# EAGLE design dualevse (EAGLE 9.5.0)
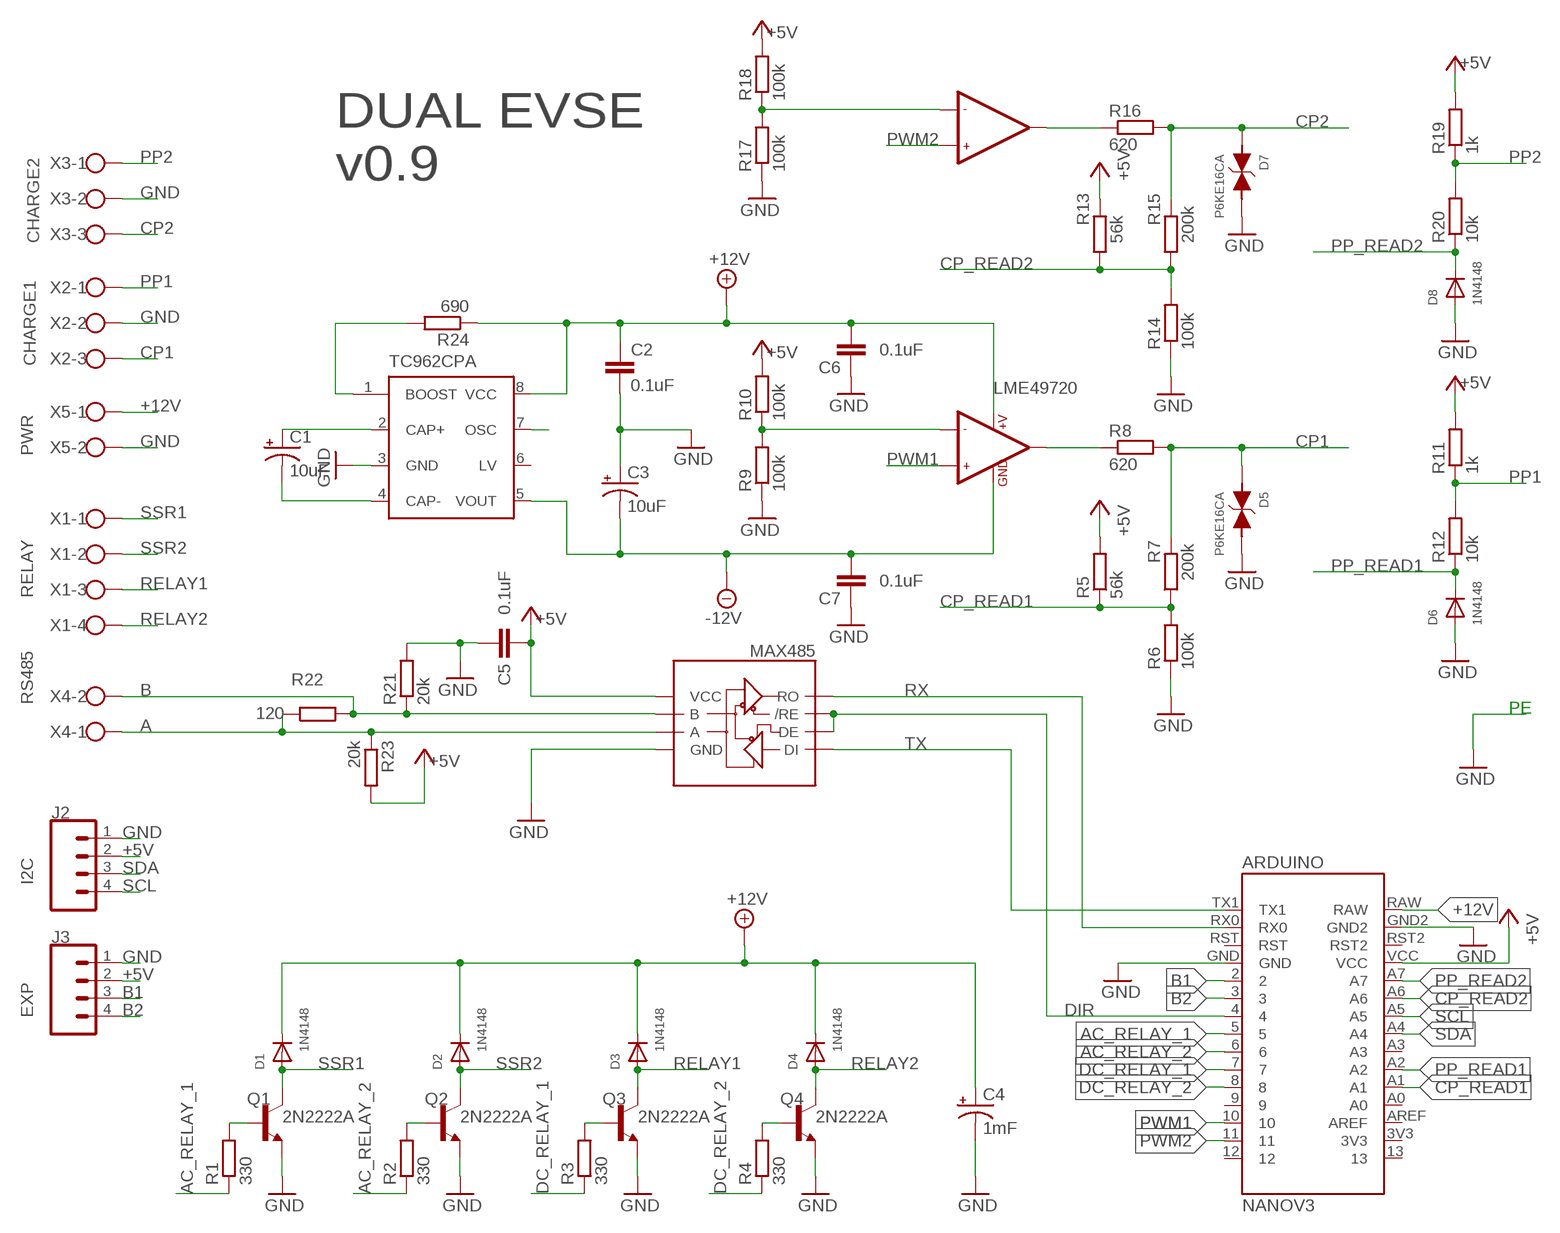
[diagram p0: schematic, sheet 1]

## Parts
ARDUINO  NANOV3  [NANOV3]
C1  10uF  10UF-POLAR-RADIAL-2.5MM-25V-20%  [CPOL-RADIAL-2.5MM-5MM]
C2  0.1uF  0.1UF-KIT-EZ-50V-20%  [CAP-PTH-SMALL-KIT]
C3  10uF  10UF-POLAR-RADIAL-2.5MM-25V-20%  [CPOL-RADIAL-2.5MM-5MM]
C4  1mF  1000UF-RADIAL-5MM-25V-20%  [CPOL-RADIAL-5MM-10MM]
C5  0.1uF  0.1UF-KIT-EZ-50V-20%  [CAP-PTH-SMALL-KIT]
C6  0.1uF  0.1UF-KIT-EZ-50V-20%  [CAP-PTH-SMALL-KIT]
C7  0.1uF  0.1UF-KIT-EZ-50V-20%  [CAP-PTH-SMALL-KIT]
D1  1N4148  DIODEDO-1N4148  [DO-1N4148]
D2  1N4148  DIODEDO-1N4148  [DO-1N4148]
D3  1N4148  DIODEDO-1N4148  [DO-1N4148]
D4  1N4148  DIODEDO-1N4148  [DO-1N4148]
D5  P6KE16CA  TVSDO2  [C4111-15]
D6  1N4148  DIODEDO-1N4148  [DO-1N4148]
D7  P6KE16CA  TVSDO2  [C4111-15]
D8  1N4148  DIODEDO-1N4148  [DO-1N4148]
J2  I2C  CONN_04POLAR  [MOLEX-1X4]
J3  EXP  CONN_04POLAR  [MOLEX-1X4]
LME49720  LME49720  LF353DIL08  [TEXAS_DIL08]
MAX485  SPARKFUN-IC-COMMS_RS485  [TEXAS_DIL08]
Q1  2N2222A  [TO18]
Q2  2N2222A  [TO18]
Q3  2N2222A  [TO18]
Q4  2N2222A  [TO18]
R1  330  R-EU_0207/10  [0207/10]
R2  330  R-EU_0207/10  [0207/10]
R3  330  R-EU_0207/10  [0207/10]
R4  330  R-EU_0207/10  [0207/10]
R5  56k  R-EU_0207/10  [0207/10]
R6  100k  R-EU_0207/10  [0207/10]
R7  200k  R-EU_0207/10  [0207/10]
R8  620  R-EU_0207/10  [0207/10]
R9  100k  R-EU_0207/10  [0207/10]
R10  100k  R-EU_0207/10  [0207/10]
R11  1k  R-EU_0207/10  [0207/10]
R12  10k  R-EU_0207/10  [0207/10]
R13  56k  R-EU_0207/10  [0207/10]
R14  100k  R-EU_0207/10  [0207/10]
R15  200k  R-EU_0207/10  [0207/10]
R16  620  R-EU_0207/10  [0207/10]
R17  100k  R-EU_0207/10  [0207/10]
R18  100k  R-EU_0207/10  [0207/10]
R19  1k  R-EU_0207/10  [0207/10]
R20  10k  R-EU_0207/10  [0207/10]
R21  20k  R-EU_0207/10  [0207/10]
R22  120  R-EU_0207/10  [0207/10]
R23  20k  R-EU_0207/10  [0207/10]
R24  690  R-EU_0207/10  [0207/10]
TC962CPA  TEXAS_TL7660  [TEXAS_DIL08]
X1  RELAY  W237-4  [W237-4]
X2  CHARGE1  W237-103  [W237-103]
X3  CHARGE2  W237-103  [W237-103]
X4  RS485  W237-102  [W237-102]
X5  PWR  W237-102  [W237-102]

## Nets
+5V [PWR]: ARDUINO.VCC C5.2 J2.2 J3.2 MAX485.8(VCC) R5.2 R10.2 R11.2 R13.2 R18.2 R19.2 R23.2
+12V [PWR]: ARDUINO.RAW C2.1 C4.+ C6.1 D1.C D2.C D3.C D4.C LME49720.8(+V) R24.1 TC962CPA.8(VCC) X5.1
-12V [PWR]: C3.2(-) C7.2 LME49720.4(GND) TC962CPA.5(VOUT)
A: MAX485.6(A) R22.1 R23.1 X4.1
AC_RELAY_1: ARDUINO.5 R1.1
AC_RELAY_2: ARDUINO.6 R2.1
B: MAX485.7(B) R21.1 R22.2 X4.2
B1: ARDUINO.2 J3.3
B2: ARDUINO.3 J3.4
CP1 [PWR]: D5.A R7.2 R8.2 X2.3
CP2 [PWR]: D7.A R15.2 R16.2 X3.3
CP_READ1: ARDUINO.A1 R5.1 R6.2 R7.1
CP_READ2: ARDUINO.A6 R13.1 R14.2 R15.1
DC_RELAY_1: ARDUINO.7 R3.1
DC_RELAY_2: ARDUINO.8 R4.1
DIR: ARDUINO.4 MAX485.2(/RE) MAX485.3(DE)
GND [GND]: ARDUINO.GND ARDUINO.GND2 C2.2 C3.1(+) C4.- C5.1 C6.2 C7.1 D5.C D6.A D7.C D8.A J2.1 J3.1 MAX485.5(GND) Q1.1(E) Q2.1(E) Q3.1(E) Q4.1(E) R6.1 R9.1 R14.1 R17.1 R21.2 TC962CPA.3(GND) X2.2 X3.2 X5.2
N$1: LME49720.6(-IN2) R17.2 R18.1
N$2: Q3.2(B) R3.2
N$3: Q4.2(B) R4.2
N$4: LME49720.7(OUT2) R16.1
N$5: Q1.2(B) R1.2
N$6: Q2.2(B) R2.2
N$7 [PWR]: R24.2 TC962CPA.1(BOOST)
N$10: LME49720.2(-IN1) R9.2 R10.1
N$11: LME49720.1(OUT1) R8.1
N$36: C1.1(+) TC962CPA.2(CAP+)
N$38: C1.2(-) TC962CPA.4(CAP-)
NC: TC962CPA.7(OSC)
PP1 [PWR]: R11.1 R12.2 X2.1
PP2 [PWR]: R19.1 R20.2 X3.1
PP_READ1: ARDUINO.A2 D6.C R12.1
PP_READ2: ARDUINO.A7 D8.C R20.1
PWM1: ARDUINO.10 LME49720.3(+IN1)
PWM2: ARDUINO.11 LME49720.5(+IN2)
RELAY1 [PWR]: D3.A Q3.3(C) X1.3
RELAY2 [PWR]: D4.A Q4.3(C) X1.4
RX: ARDUINO.RX0 MAX485.1(RO)
SCL: ARDUINO.A5 J2.4
SDA: ARDUINO.A4 J2.3
SSR1 [PWR]: D1.A Q1.3(C) X1.1
SSR2 [PWR]: D2.A Q2.3(C) X1.2
TX: ARDUINO.TX1 MAX485.4(DI)
Unconnected: ARDUINO.3V3 ARDUINO.9 ARDUINO.12 ARDUINO.13 ARDUINO.A0 ARDUINO.A3 ARDUINO.AREF ARDUINO.RST ARDUINO.RST2 TC962CPA.6(LV)

## Notes on the sheet
- DUAL EVSE
  v0.9
- PE

## Library data of the parts
ARDUINO = Arduino Nano by Jazz:NANOV3
C1 C3 = SparkFun-Capacitors:10UF-POLAR: 10.0µF polarized capacitors A capacitor is a passive two-terminal electrical component used to store electrical energy temporarily in an electric field.; PROD_ID: CAP-08440
C2 C5-C7 = SparkFun-Capacitors:0.1UF: 0.1µF ceramic capacitors A capacitor is a passive two-terminal electrical component used to store electrical energy temporarily in an electric field.; PROD_ID: CAP-08370
C4 = SparkFun-Capacitors:1000UF: 1,000µF/1mF ceramic capacitors A capacitor is a passive two-terminal electrical component used to store electrical energy temporarily in an electric field. CAP-08070; PROD_ID: CAP-09538
D1-D4 D6 D8 = adafruit:DIODE: Diode SMADIODE - SMA Surface Mount Package 20V 1A Schottky Diode Digikey: 641-1014-6-ND DO-1N4148 - Through Hole Small Current Diode SOD-123 20V 1 A (.5mV Vf) Schottky Diode - Digikey: MBRX120TPMSCT-ND SOD-323 10V 570mA (.38mV Vf, 3ns) Schottky Diode - Digikey: ZLLS410CT-ND SOD-523 30V 30mA Schottky Diode (RB751S-40TE61) - Digikey: RB751S-40TE61CT-ND SOT23-R/W - SOT23 Package (R = Solder Paste/Reflow Ovens, W = Hand-Soldering) BAT54Film 40V 300mA - Digikey: 497-7162-1-ND
D5 D7 = evse_nano:TVS: WE-TVSP Power TVS Diode <http://katalog.we-online.de/media/images/v2/WE-TVSP_600W-3000W_D0214AA_4C.jpg> Details see: http://katalog.we-online.de/en/pbs/WE-TVSP/824500101 2015 (C) Würth Elektronik
J2 J3 = SparkFun-Connectors:CONN_04: Multi connection point. Often used as Generic Header-pin footprint for 0.1 inch spaced/style header connections On any of the 0.1 inch spaced packages, you can populate with these: Break Away Headers - Straight <https://www.sparkfun.com/products/116> (PRT-00116) Break Away Male Headers - Right Angle <https://www.sparkfun.com/products/553> (PRT-00553) Female Headers <https://www.sparkfun.com/products/115> (PRT-00115) Break Away Headers - Machine Pin <https://www.sparkfun.com/products/117> (PRT-00117) Break Away Female Headers - Swiss Machine Pin <https://www.sparkfun.com/products/743> (PRT-00743) For SCREWTERMINALS and SPRING TERMINALS visit here: Screw Terimnals on SparkFun.com <https://www.sparkfun.com/search/results?term=Screw+Terminals> (5mm/3.5mm/2.54mm spacing) This device is also useful as a general connection point to wire up your design to another part of your project. Our various solder wires solder well into these plated through hole pads. Hook-Up Wire - Assortment (Stranded, 22 AWG) <https://www.sparkfun.com/products/11375> (PRT-11375) Hook-Up Wire - Assortment (Solid Core, 22 AWG) <https://www.sparkfun.com/products/11367> (PRT-11367) View the entire wire category on our website here <https://www.sparkfun.com/categories/141> Special notes: Molex polarized connector foot print use with SKU : PRT-08231 with associated crimp pins and housings. 1MM SMD Version SKU: PRT-10208; PROD_ID: CONN-08186; SF_ID: PRT-08231
LME49720 = evse_nano:LF353
MAX485 = evse_nano:SPARKFUN-IC-COMMS_RS485: RS-485 Transceiver SP3485 Series 8 Pin NSOIC 3.3 V Low Power Half Duplex RS-485 Transceiver MAX3485 compatible Datasheet <http://www.sparkfun.com/datasheets/Components/General/sp3485CN-LTR.pdf> SparkFun Products SparkFun Transceiver Breakout - RS-485 <https://www.sparkfun.com/products/10124> (BOB-10124) SparkFun USB to RS-485 Converter <https://www.sparkfun.com/products/9822> (BOB-09822)
Q1-Q4 = transistor-npn:2N2222*: NPN Transistor
R1-R24 = resistor:R-EU_: RESISTOR, European symbol
TC962CPA = evse_nano:TEXAS_TL7660: CMOS VOLTAGE CONVERTER Source: http://focus.ti.com/lit/ds/scas794/scas794.pdf
X1 = con-wago-500:W237-4: WAGO SCREW CLAMP; OC_FARNELL: unknown; OC_NEWARK: unknown
X2 X3 = con-wago-500:W237-103: WAGO SCREW CLAMP; MPN: 237-103; OC_FARNELL: unknown; OC_NEWARK: 18M7116
X4 X5 = con-wago-500:W237-102: WAGO SCREW CLAMP; MPN: 237-102; OC_FARNELL: unknown; OC_NEWARK: 70K9898

## Net classes
0 default: width 0.508 mm, drill 0.254 mm, clearance 0.254 mm
1 GND: width 1.016 mm, drill 0.508 mm, clearance 0.254 mm
4 PWR: width 1.016 mm, drill 0.508 mm, clearance 0.254 mm to class 2, clearance 0.254 mm

## Board
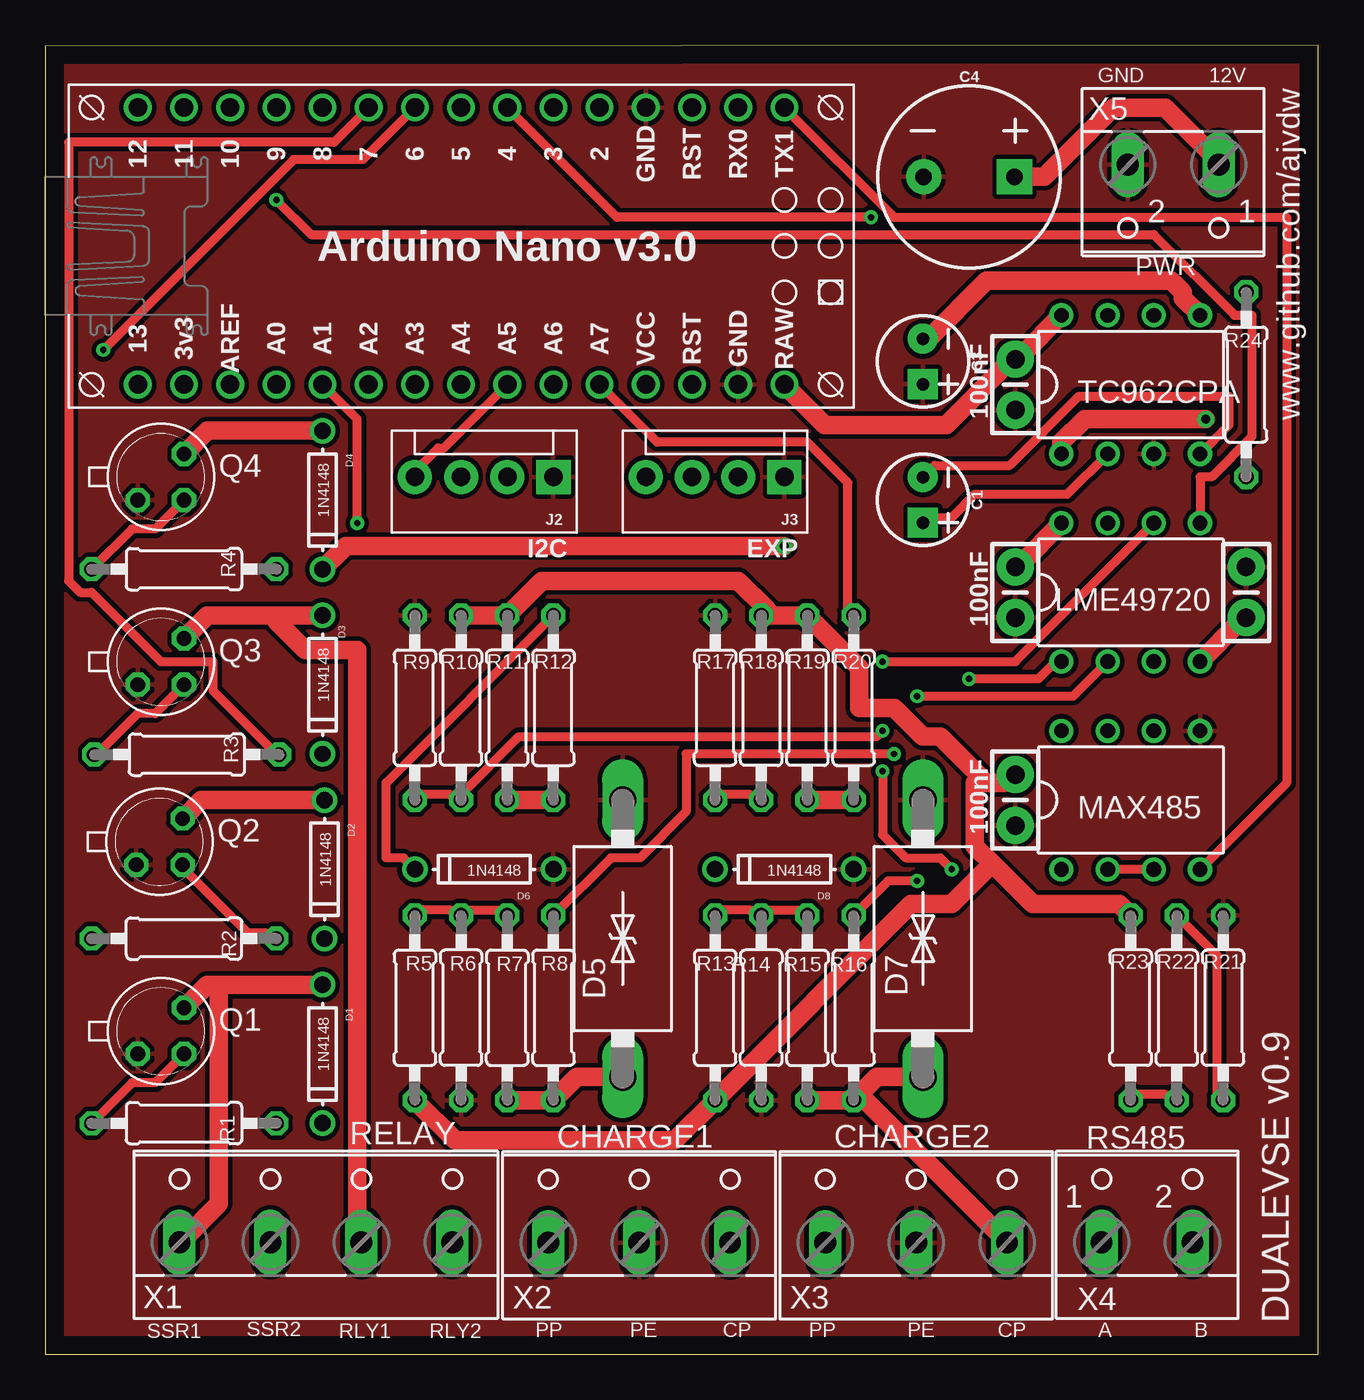
[diagram p1: board, top side]
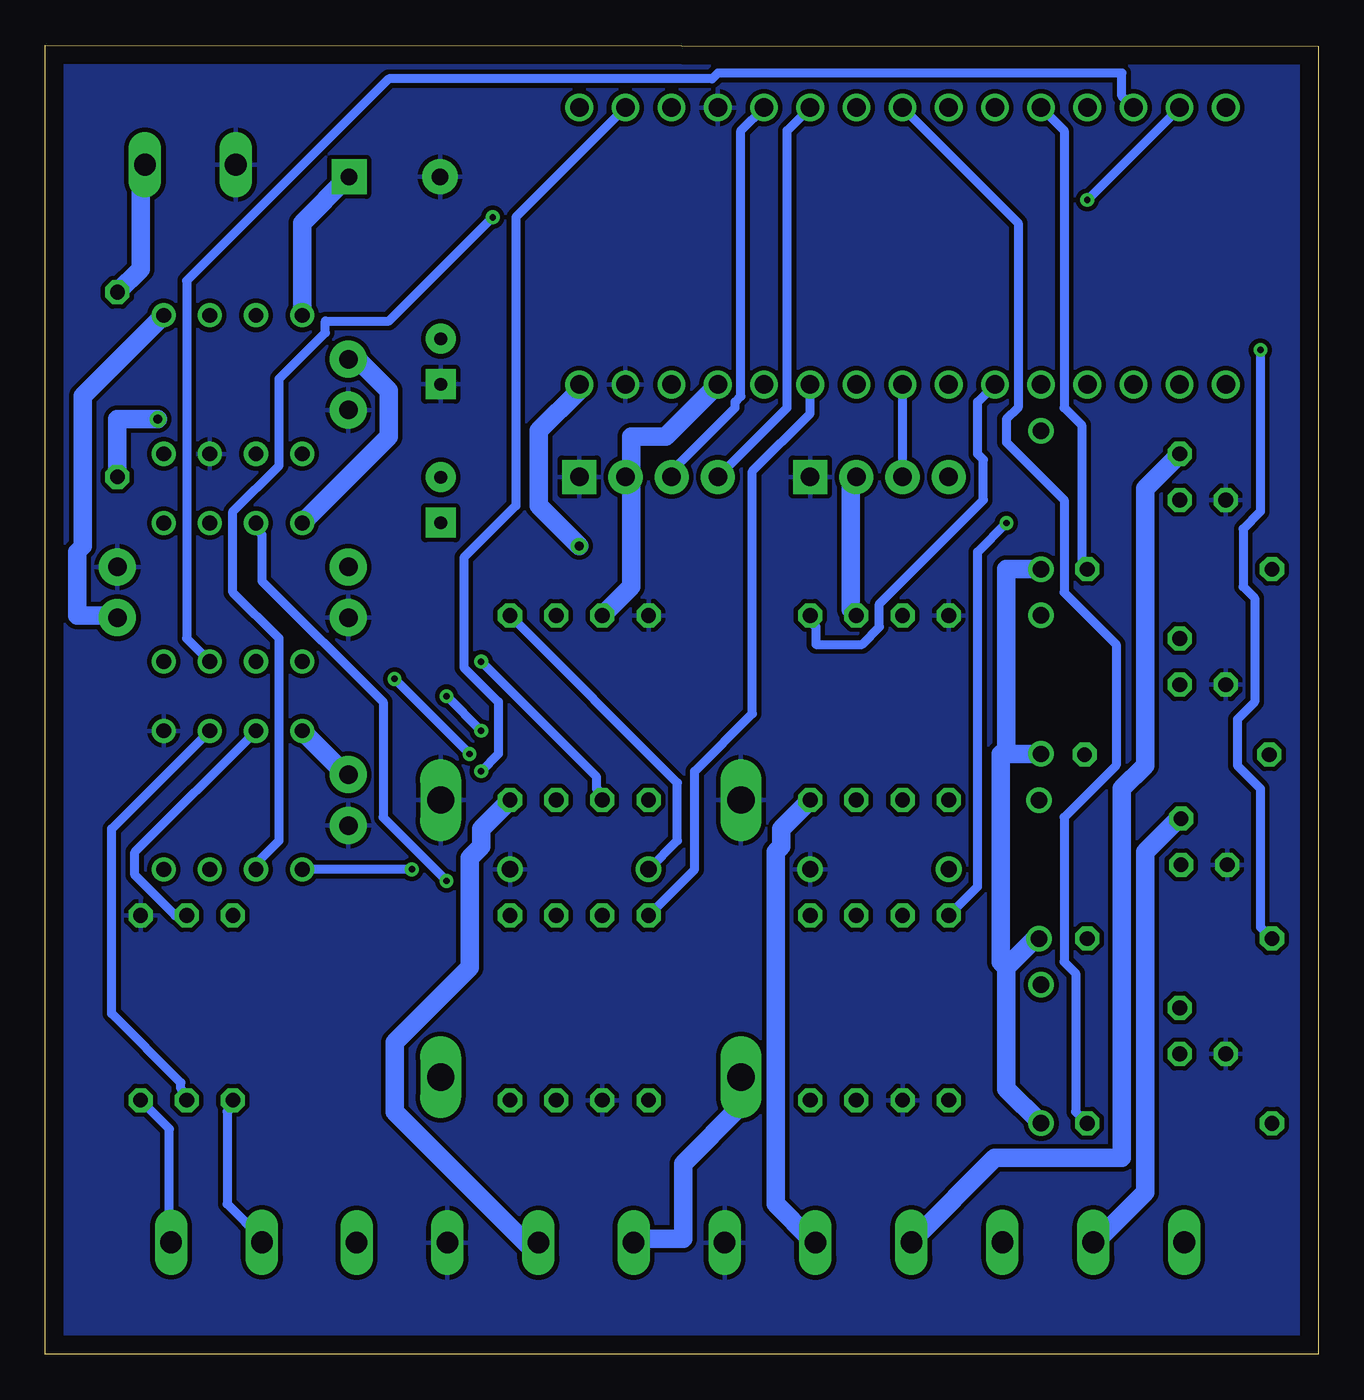
[diagram p2: board, bottom side, seen from below]

Size 70 x 72 mm. Coordinates in mm from the lower left corner, seen from the top.
Outline: 0,0 70,0 70,72 0,71.97 0,0
Copper layers (1*16): Top 0.035mm / dielectric 1.5mm / Bottom 0.035mm
Design rules "default": minimum track width 6mil, minimum drill 0.35mm, track to track 6mil, track to pad 6mil, pad to pad 6mil, via to via 6mil, smd to smd 6mil, copper to edge 40mil, drill to drill 6mil, minimum pad ring 10mil, minimum via ring 8mil, stop-mask expansion 4mil, vias tented up to drill 0mil, thermal gap 10mil

### Footprints (pad centres in the part's own frame; a part is rotated, then mirrored left to right if it is on the bottom)
NANOV3 = drill 1.016: 2 -7.62,5.08; 3 -7.62,2.54; 3V3 7.62,-17.78; 4 -7.62,0; 5 -7.62,-2.54; 6 -7.62,-5.08; 7 -7.62,-7.62; 8 -7.62,-10.16; 9 -7.62,-12.7; 10 -7.62,-15.24; 11 -7.62,-17.78; 12 -7.62,-20.32; 13 7.62,-20.32; A0 7.62,-12.7; A1 7.62,-10.16; A2 7.62,-7.62; A3 7.62,-5.08; A4 7.62,-2.54; A5 7.62,0; A6 7.62,2.54; A7 7.62,5.08; AREF 7.62,-15.24; GND -7.62,7.62; GND2 7.62,12.7; RAW 7.62,15.24; RST -7.62,10.16; RST2 7.62,10.16; RX0 -7.62,12.7; TX1 -7.62,15.24; VCC 7.62,7.62
CPOL-RADIAL-2.5MM-5MM = drill 0.7 pad 1.651 square: 1 1.25,0 | drill 0.7 pad 1.651: 2 -1.25,0
CAP-PTH-SMALL-KIT = drill 1.016 pad 2.032: 1 -1.397,0; 2 1.397,0
CPOL-RADIAL-5MM-10MM = drill 0.9 pad 1.93 square: + 2.5,0 | drill 0.9 pad 1.93: - -2.5,0
DO-1N4148 = drill 0.9: A -3.81,0; C 3.81,0
C4111-15 = drill 1.499 long: A 7.62,0; C -7.62,0
MOLEX-1X4 = drill 1.016 pad 1.88 square: 1 0,0 | drill 1.016 pad 1.88: 2 2.54,0; 3 5.08,0; 4 7.62,0
TEXAS_DIL08 = drill 0.813 pad 1.27: 1 -3.81,-3.81; 2 -1.27,-3.81; 3 1.27,-3.81; 4 3.81,-3.81; 5 3.81,3.81; 6 1.27,3.81; 7 -1.27,3.81; 8 -3.81,3.81
TO18 = drill 0.813 octagon: 1 -1.27,-1.27; 2 1.27,-1.27; 3 1.27,1.27
0207/10 = drill 0.813 octagon: 1 -5.08,0; 2 5.08,0
W237-4 = drill 1.194 long: 1 -7.5,-1.27; 2 -2.5,-1.27; 3 2.5,-1.27; 4 7.5,-1.27
W237-103 = drill 1.194 long: 1 -5,-1.29; 2 0,-1.29; 3 5,-1.29
W237-102 = drill 1.194 long: 1 -2.5,-1.27; 2 2.5,-1.27

### Placement (x,y rotation side)
ARDUINO  25.4,60.96 270 top
C1  48.26,46.99 270 top
C2  53.34,53.34 270 top
C3  48.26,54.61 270 top
C4  50.8,64.77 0 top
C5  53.34,30.48 90 top
C6  53.34,41.91 270 top
C7  66.04,41.91 270 top
D1  15.24,16.51 270 top
D2  15.35,26.67 270 top
D3  15.24,36.83 270 top
D4  15.24,46.99 270 top
D5  31.75,22.86 270 top
D6  24.13,26.67 180 top
D7  48.26,22.86 270 top
D8  40.64,26.67 180 top
J2  27.94,48.26 180 top
J3  40.64,48.26 180 top
LME49720  59.69,41.91 0 top
MAX485  59.69,30.48 0 top
Q1  6.35,17.78 0 top
Q2  6.27,28.19 0 top
Q3  6.35,38.1 0 top
Q4  6.35,48.26 0 top
R1  7.62,12.7 180 top
R2  7.62,22.86 0 top
R3  7.77,32.98 180 top
R4  7.62,43.18 180 top
R5  20.32,19.05 270 top
R6  22.86,19.05 90 top
R7  25.4,19.05 270 top
R8  27.94,19.05 270 top
R9  20.32,35.56 270 top
R10  22.86,35.56 90 top
R11  25.4,35.56 90 top
R12  27.94,35.56 270 top
R13  36.83,19.05 270 top
R14  39.37,19.05 90 top
R15  41.91,19.05 270 top
R16  44.45,19.05 270 top
R17  36.83,35.56 270 top
R18  39.37,35.56 90 top
R19  41.91,35.56 90 top
R20  44.45,35.56 270 top
R21  64.77,19.05 90 top
R22  62.23,19.05 90 top
R23  59.69,19.05 90 top
R24  66.04,53.34 270 top
TC962CPA  59.69,53.34 0 top
X1  14.87,7.42 0 top
X2  32.65,7.42 0 top
X3  47.89,7.42 0 top
X4  60.59,7.42 0 top
X5  62.03,64.17 180 top

### Tracks (layer width: path | path; a pad name or v marks a point on that pad's centre or on a via)
+5V
  Top 1.016: R10.2 R11.2 27.3,42.55 38.1,42.55 39.69,40.96 R18.2 R19.2 44.77,37.78 44.77,35.56 46.67,35.56 48.26,33.97 49.21,33.97 51.44,31.75 51.12,31.43 | R5.2 22.54,11.75 34.61,11.75 R13.2 47.62,24.77 49.85,24.77 52.07,26.99 | R23.2 59.05,24.77 54.29,24.77 52.07,26.99 | 52.07,26.99 51.12,27.94 51.12,31.43 | 51.12,31.43 52.7,31.43 53.02,31.75 53.34,31.75 C5.2
  Bottom 1.016: R11.2 25.72,40.96 25.72,47.62 25.4,47.94 J2.2 | ARDUINO.VCC 35.88,50.48 37.78,50.48 37.78,48.9 38.1,48.58 J3.2 37.78,47.94 37.78,42.23 R18.2 | MAX485.8 53.34,31.75 C5.2
+12V  (via drill 0.51)
  Top 1.016: LME49720.8 53.66,43.5 53.34,43.5 C6.1 | TC962CPA.8 53.66,54.93 53.34,54.93 C2.1 53.34,54.29 52.7,54.29 49.53,51.12 42.86,51.12 ARDUINO.RAW | C4.+ 54.93,64.77 58.74,68.58 61.59,68.58 64.45,65.72 X5.1 | D4.C 16.51,44.45 v40.64,44.45
  Bottom 1.016: D1.C 17.14,14.61 17.14,21.27 | 17.14,21.27 15.56,22.86 D2.C | 17.14,33.02 17.46,33.02 17.46,21.59 17.14,21.27 | 17.14,33.02 D3.C | D4.C 17.14,43.18 17.14,33.02 | R24.1 64.77,59.69 64.77,65.41 X5.1 | TC962CPA.8 55.88,62.23 53.34,64.77 C4.+ | LME49720.8 51.12,50.48 51.12,53.02 52.7,54.61 53.34,54.61 C2.1 | v40.64,44.45 42.86,46.67 42.86,50.8 40.64,53.02 ARDUINO.RAW
-12V
  Top 1.016: LME49720.4 65.72,40.32 66.04,40.32 C7.2 | TC962CPA.5 62.55,58.1 62.55,58.42 61.91,59.05 51.75,59.05 48.58,55.88 48.26,55.88 C3.2
  Bottom 1.016: TC962CPA.5 67.94,52.7 67.94,44.45 68.26,44.13 68.26,40.64 66.04,40.64 C7.2
A
  Top 0.508: R23.1 60.01,14.29 61.59,14.29 61.91,13.97 R22.1
  Bottom 0.508: MAX485.6 66.36,28.89 66.36,18.73 62.55,14.92 62.55,14.61 62.23,14.29 R22.1 | R23.1 59.69,13.65 60.01,13.34 60.01,8.26 58.1,6.35 X4.1
AC_RELAY_1
  Bottom 0.508: R1.1 13.34,13.34 13.34,20.95 13.97,21.59 13.97,29.53 11.11,32.38 11.11,39.05 13.97,41.91 13.97,46.99 17.14,50.16 17.14,51.44 16.51,52.07 16.51,62.23 ARDUINO.5
AC_RELAY_2  (via drill 0.35)
  Top 0.508: v3.17,55.24 13.65,65.72 17.46,65.72 ARDUINO.6
  Bottom 0.508: R2.1 3.17,23.5 3.17,31.11 4.45,32.38 4.45,34.92 3.49,35.88 3.49,41.59 4.13,42.23 4.13,45.4 3.17,46.35 v3.17,55.24
B
  Top 0.508: R22.2 64.45,21.91 64.45,13.97 R21.1
  Bottom 0.508: R21.1 63.18,12.38 63.18,6.35 X4.2 | MAX485.7 65.09,27.62 65.09,26.35 62.87,24.13 R22.2
B1
  Bottom 0.508: ARDUINO.2 31.75,67.31 31.75,52.7 32.07,52.39 32.07,52.07 35.56,48.58 J3.3
B2
  Bottom 0.508: ARDUINO.3 29.21,67.31 29.21,52.07 J3.4
CP1
  Top 1.016: R7.2 R8.2 29.21,15.24 D5.A
  Bottom 1.016: D5.A 31.75,13.65 34.92,10.48 34.92,6.35 37.47,6.35 X2.3
CP2
  Top 1.016: R16.2 R15.2 | R16.2 45.72,15.24 D7.A | X3.3 52.7,6.35 45.09,13.97 R16.2
CP_READ1  (via drill 0.35)
  Top 0.508: R5.1 20.64,24.45 22.23,24.45 22.54,24.13 R6.2 22.54,24.45 25.08,24.45 R7.1 | ARDUINO.A1 17.14,51.44 v17.14,45.72
  Bottom 0.508: v17.14,45.72 18.73,44.13 18.73,25.72 R5.1
CP_READ2
  Top 0.508: R13.1 37.15,24.45 38.73,24.45 39.05,24.13 R14.2 39.05,24.45 41.59,24.45 R15.1
  Bottom 0.508: ARDUINO.A6 27.94,51.75 31.11,48.58 31.11,35.24 34.29,32.07 34.29,26.67 R13.1
DC_RELAY_1
  Top 0.508: ARDUINO.7 15.88,66.67 1.27,66.67 1.27,42.55 1.91,41.91 2.54,41.91 6.35,38.1 9.21,38.1 9.21,36.51 12.7,33.02 R3.1
DC_RELAY_2
  Bottom 0.508: R4.1 13.02,43.5 13.02,51.12 13.97,52.07 13.97,67.31 ARDUINO.8
DIR  (via drill 0.35)
  Top 0.508: MAX485.3 MAX485.2 | ARDUINO.4 31.43,62.55 v45.4,62.55
  Bottom 0.508: v45.4,62.55 51.12,56.83 54.61,56.83 54.61,56.2 57.15,53.66 57.15,48.9 59.69,46.35 59.69,41.91 57.15,39.37 57.15,28.26 58.42,26.99 MAX485.2
GND
  pour Top: -5.08,-3.81 -5.08,77.47 74.93,77.47 74.93,-3.86
  pour Bottom: -2.87,73.29 72.7,73.35 72.7,-1.44 -1.9,-1.44
N$1  (via drill 0.35)
  Top 0.508: R17.2 37.15,30.8 38.73,30.8 39.05,30.48 R18.1 | LME49720.6 53.34,38.1 v46.04,38.1
  Bottom 0.508: v46.04,38.1 39.69,31.75 39.69,31.11 39.37,30.8 R18.1
N$2
  Top 0.508: Q3.2 6.03,35.24 5.08,35.24 2.86,33.02 R3.2
N$3
  Top 0.508: R4.2 4.76,45.4 6.03,45.4 Q4.2
N$4  (via drill 0.35)
  Top 0.508: R16.1 46.35,26.04 v47.94,26.04
  Bottom 0.508: v47.94,26.04 51.44,29.53 51.44,35.88 58.1,42.55 58.1,45.09 58.42,45.4 LME49720.7
N$5
  Top 0.508: R1.2 4.76,14.92 6.03,14.92 Q1.2
N$6
  Top 0.508: R2.2 12.38,22.86 12.06,23.18 11.11,23.18 7.62,26.67 Q2.2
N$7  (via drill 0.51)
  Top 1.016: TC962CPA.1 55.88,50.16 57.15,51.44 v63.82,51.44
  Bottom 1.016: v63.82,51.44 66.04,51.44 R24.2
N$10  (via drill 0.35)
  Top 0.508: R9.2 20.64,30.8 22.23,30.8 22.54,30.48 R10.1 22.54,30.8 22.86,30.8 26.04,33.97 45.72,33.97 v46.04,34.29 | LME49720.2 56.52,36.2 v47.94,36.2
  Bottom 0.508: v46.04,34.29 v47.94,36.2
N$11  (via drill 0.35)
  Top 0.508: R8.1 31.11,27.3 32.7,27.3 35.24,29.84 35.24,33.02 v46.67,33.02 | v50.8,37.15 54.61,37.15 55.56,38.1 LME49720.1
  Bottom 0.508: v50.8,37.15 v46.67,33.02
N$36
  Top 0.508: TC962CPA.2 56.2,47.31 51.12,47.31 49.85,46.04 48.26,46.04 C1.1
N$38
  Top 0.508: TC962CPA.4 65.09,51.12 65.09,52.7 56.83,52.7 53.02,48.9 48.9,48.9 48.26,48.26 C1.2
PP1
  Top 1.016: R12.2 R11.1
  Bottom 1.016: R12.2 29.53,28.89 29.53,27.94 29.84,27.62 29.84,8.26 27.94,6.35 X2.1
PP2
  Top 1.016: R20.2 R19.1
  Bottom 1.016: R20.2 46.04,28.89 46.04,27.94 46.67,27.3 46.67,21.27 50.8,17.14 50.8,13.34 43.18,5.71 42.86,5.71 42.86,6.03 X3.1
PP_READ1
  Top 0.508: R12.1 18.73,31.43 18.73,27.3 19.68,27.3 D6.C
  Bottom 0.508: ARDUINO.A2 18.73,52.39 18.73,49.53 18.41,49.21 18.41,46.99 24.13,41.27 24.13,40.01 25.08,39.05 27.62,39.05 27.62,40.01 27.94,40.32 R12.1
PP_READ2
  Top 0.508: ARDUINO.A7 33.66,50.16 41.91,50.16 44.13,47.94 44.13,40.64 R20.1
  Bottom 0.508: R20.1 35.24,31.43 35.24,28.26 D8.C
PWM1
  Bottom 0.508: LME49720.3 62.23,39.37 62.23,59.05 51.12,70.17 33.34,70.17 33.02,70.48 10.79,70.48 10.79,69.22 ARDUINO.10
PWM2  (via drill 0.35)
  Top 0.508: LME49720.5 63.5,48.26 64.14,48.26 66.36,50.48 66.36,57.15 65.41,57.15 60.96,61.59 14.61,61.59 v12.7,63.5
  Bottom 0.508: ARDUINO.11 v12.7,63.5
RELAY1
  Top 1.016: Q3.3 8.89,40.64 12.7,40.64 | D3.A 12.7,40.64 | X1.3 17.14,6.35 17.14,38.73 14.29,38.73 12.7,40.32 12.7,40.64
RELAY2
  Top 1.016: Q4.3 8.89,50.8 D4.A
  Bottom 1.016: Q4.3 9.53,47.62 9.53,32.38 10.79,31.11 10.79,10.79 17.78,10.79 22.23,6.35 X1.4
RX  (via drill 0.35)
  Top 0.508: v49.85,26.67 49.21,27.3 47.31,27.3 46.04,28.57 v46.04,32.07
  Bottom 0.508: v49.85,26.67 MAX485.1 | v46.04,32.07 45.09,33.02 45.09,35.88 46.99,37.78 46.99,43.81 44.13,46.67 44.13,62.55 ARDUINO.RX0
SCL
  Top 0.508: ARDUINO.A5 21.91,49.85 21.59,49.85 20.64,48.9 20.64,48.26 J2.4
SDA
  Bottom 0.508: J2.3 ARDUINO.A4
SSR1
  Top 1.016: Q1.3 8.89,20.32 9.53,20.32 | D1.A 9.53,20.32 | 9.53,20.32 9.53,8.26 7.62,6.35 X1.1
SSR2
  Top 1.016: D2.A 8.57,30.48 7.62,29.53 Q2.3
  Bottom 1.016: X1.2 12.06,6.35 9.53,8.89 9.53,27.62 7.62,29.53 Q2.3
TX
  Top 0.508: MAX485.4 68.26,31.43 68.26,62.55 46.67,62.55 ARDUINO.TX1

### Text on the board
tNames: www.github.com/ajvdw | 100nF | 100nF | 100nF | DUALEVSE v0.9